# Altium schematic sheet AfternoonCape_RevA2_ADImux.SchDoc
size A2
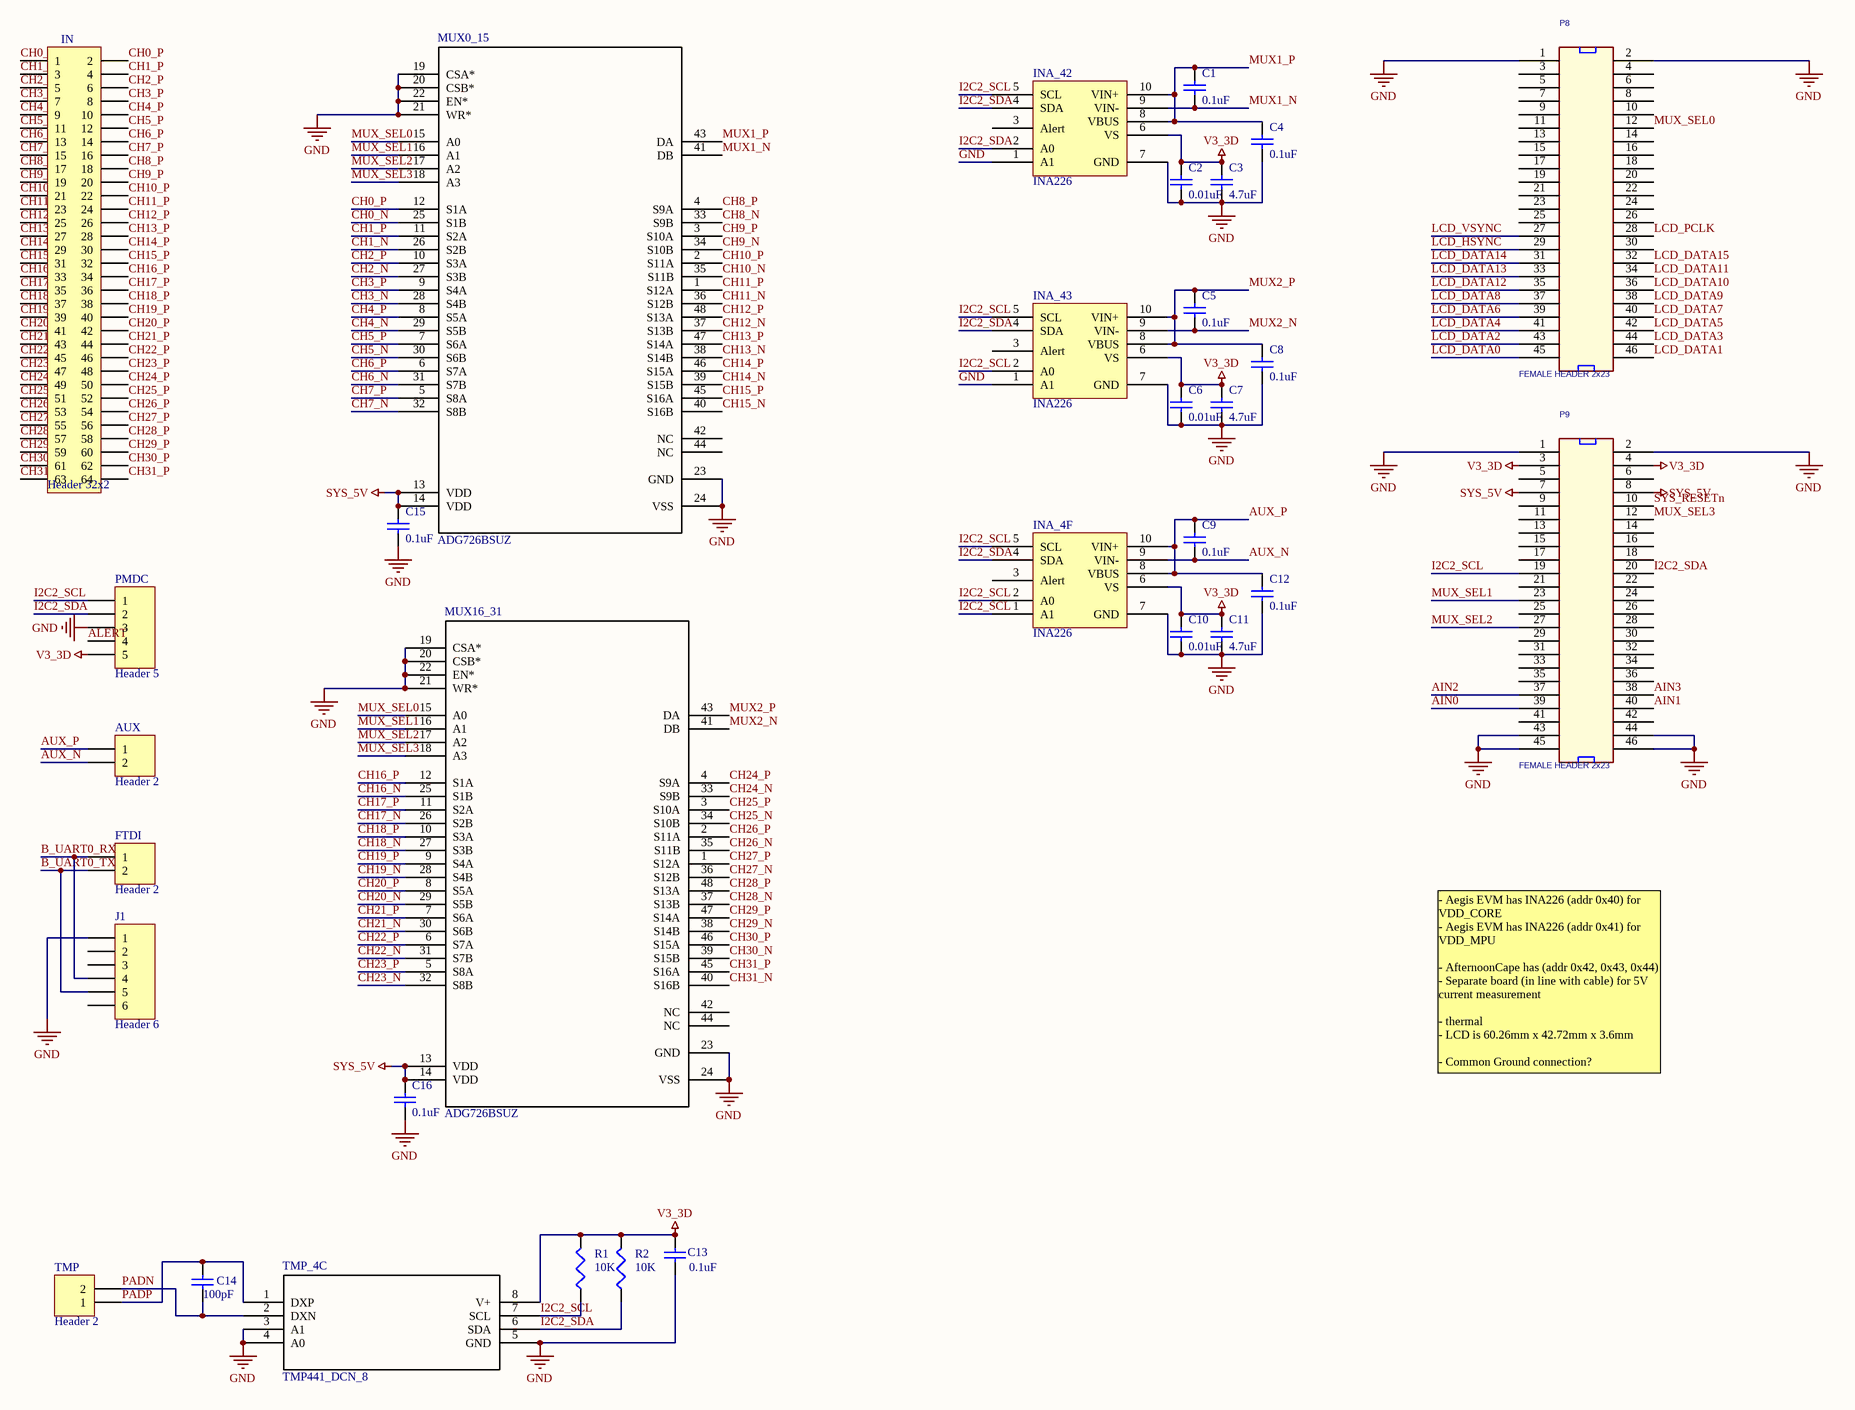
[diagram p0: AfternoonCape_RevA2_ADImux.SchDoc]

## Parts
AUX  Header 2  [HDR1X2]
C1  value 0.1uF  [0402]  (hidden comment: Cap Semi)
C2  value 0.01uF  [0402]  (hidden comment: Cap Semi)
C3  value 4.7uF  [0402]  (hidden comment: Cap Semi)
C4  value 0.1uF  [0402]  (hidden comment: Cap Semi)
C5  value 0.1uF  [0402]  (hidden comment: Cap Semi)
C6  value 0.01uF  [0402]  (hidden comment: Cap Semi)
C7  value 4.7uF  [0402]  (hidden comment: Cap Semi)
C8  value 0.1uF  [0402]  (hidden comment: Cap Semi)
C9  value 0.1uF  [0402]  (hidden comment: Cap Semi)
C10  value 0.01uF  [0402]  (hidden comment: Cap Semi)
C11  value 4.7uF  [0402]  (hidden comment: Cap Semi)
C12  value 0.1uF  [0402]  (hidden comment: Cap Semi)
C13  value 0.1uF  [0402]  (hidden comment: Cap Semi)
C14  value 100pF  [0402]  (hidden comment: Cap Semi)
C15  value 0.1uF  [0402]  (hidden comment: Cap Semi)
C16  value 0.1uF  [0402]  (hidden comment: Cap Semi)
FTDI  Header 2  [HDR1X2]
IN  Header 32x2  [HDR2x32]
INA_4F  INA226  [DGS10]
INA_42  INA226  [DGS10]
INA_43  INA226  [DGS10]
J1  Header 6  [HDR1X6]
MUX0_15  ADG726BSUZ  [SU_48]
MUX16_31  ADG726BSUZ  [SU_48]
P8  FEMALE HEADER 2x23  [HEADER23X2]
P9  FEMALE HEADER 2x23  [HEADER23X2]
PMDC  Header 5  [HDR1X5]
R1  value 10K  [0402]  (hidden comment: Res3)
R2  value 10K  [0402]  (hidden comment: Res3)
TMP  Header 2  [HDR1X2]
TMP_4C  TMP441_DCN_8  [DCN8-L]

## Nets
GND: C2.1 C3.1 C4.1 C6.1 C7.1 C8.1 C10.1 C11.1 C12.1 C13.1 C15.1 C16.1 INA_4F.7(GND) INA_42.1(A1) INA_42.7(GND) INA_43.1(A1) INA_43.7(GND) J1.1 MUX0_15.19(CSA*) MUX0_15.20(CSB*) MUX0_15.21(WR*) MUX0_15.22(EN*) MUX0_15.23(GND) MUX0_15.24(VSS) MUX16_31.19(CSA*) MUX16_31.20(CSB*) MUX16_31.21(WR*) MUX16_31.22(EN*) MUX16_31.23(GND) MUX16_31.24(VSS) P8.1 P8.2 P9.1 P9.2 P9.43 P9.44 P9.45 P9.46 PMDC.3 TMP_4C.3(A1) TMP_4C.4(A0) TMP_4C.5(GND)
SYS_5V: C15.2 C16.2 MUX0_15.13(VDD) MUX0_15.14(VDD) MUX16_31.13(VDD) MUX16_31.14(VDD) P9.7 P9.8
V3_3D: C2.2 C3.2 C6.2 C7.2 C10.2 C11.2 C13.2 INA_4F.6(VS) INA_42.6(VS) INA_43.6(VS) P9.3 P9.4 PMDC.5 R1.2 R2.2 TMP_4C.8(V+)
AIN0: P9.39
AIN1: P9.40
AIN2: P9.37
AIN3: P9.38
ALERT: PMDC.4
AUX_N: AUX.2 C9.1 INA_4F.9(VIN-)
AUX_P: AUX.1 C9.2 C12.2 INA_4F.8(VBUS) INA_4F.10(VIN+)
B_UART0_RX: FTDI.1 J1.4
B_UART0_TX: FTDI.2 J1.5
CH0_N: IN.1 MUX0_15.25(S1B)
CH0_P: IN.2 MUX0_15.12(S1A)
CH1_N: IN.3 MUX0_15.26(S2B)
CH1_P: IN.4 MUX0_15.11(S2A)
CH2_N: IN.5 MUX0_15.27(S3B)
CH2_P: IN.6 MUX0_15.10(S3A)
CH3_N: IN.7 MUX0_15.28(S4B)
CH3_P: IN.8 MUX0_15.9(S4A)
CH4_N: IN.9 MUX0_15.29(S5B)
CH4_P: IN.10 MUX0_15.8(S5A)
CH5_N: IN.11 MUX0_15.30(S6B)
CH5_P: IN.12 MUX0_15.7(S6A)
CH6_N: IN.13 MUX0_15.31(S7B)
CH6_P: IN.14 MUX0_15.6(S7A)
CH7_N: IN.15 MUX0_15.32(S8B)
CH7_P: IN.16 MUX0_15.5(S8A)
CH8_N: IN.17 MUX0_15.33(S9B)
CH8_P: IN.18 MUX0_15.4(S9A)
CH9_N: IN.19 MUX0_15.34(S10B)
CH9_P: IN.20 MUX0_15.3(S10A)
CH10_N: IN.21 MUX0_15.35(S11B)
CH10_P: IN.22 MUX0_15.2(S11A)
CH11_N: IN.23 MUX0_15.36(S12B)
CH11_P: IN.24 MUX0_15.1(S12A)
CH12_N: IN.25 MUX0_15.37(S13B)
CH12_P: IN.26 MUX0_15.48(S13A)
CH13_N: IN.27 MUX0_15.38(S14B)
CH13_P: IN.28 MUX0_15.47(S14A)
CH14_N: IN.29 MUX0_15.39(S15B)
CH14_P: IN.30 MUX0_15.46(S15A)
CH15_N: IN.31 MUX0_15.40(S16B)
CH15_P: IN.32 MUX0_15.45(S16A)
CH16_N: IN.33 MUX16_31.25(S1B)
CH16_P: IN.34 MUX16_31.12(S1A)
CH17_N: IN.35 MUX16_31.26(S2B)
CH17_P: IN.36 MUX16_31.11(S2A)
CH18_N: IN.37 MUX16_31.27(S3B)
CH18_P: IN.38 MUX16_31.10(S3A)
CH19_N: IN.39 MUX16_31.28(S4B)
CH19_P: IN.40 MUX16_31.9(S4A)
CH20_N: IN.41 MUX16_31.29(S5B)
CH20_P: IN.42 MUX16_31.8(S5A)
CH21_N: IN.43 MUX16_31.30(S6B)
CH21_P: IN.44 MUX16_31.7(S6A)
CH22_N: IN.45 MUX16_31.31(S7B)
CH22_P: IN.46 MUX16_31.6(S7A)
CH23_N: IN.47 MUX16_31.32(S8B)
CH23_P: IN.48 MUX16_31.5(S8A)
CH24_N: IN.49 MUX16_31.33(S9B)
CH24_P: IN.50 MUX16_31.4(S9A)
CH25_N: IN.51 MUX16_31.34(S10B)
CH25_P: IN.52 MUX16_31.3(S10A)
CH26_N: IN.53 MUX16_31.35(S11B)
CH26_P: IN.54 MUX16_31.2(S11A)
CH27_N: IN.55 MUX16_31.36(S12B)
CH27_P: IN.56 MUX16_31.1(S12A)
CH28_N: IN.57 MUX16_31.37(S13B)
CH28_P: IN.58 MUX16_31.48(S13A)
CH29_N: IN.59 MUX16_31.38(S14B)
CH29_P: IN.60 MUX16_31.47(S14A)
CH30_N: IN.61 MUX16_31.39(S15B)
CH30_P: IN.62 MUX16_31.46(S15A)
CH31_N: IN.63 MUX16_31.40(S16B)
CH31_P: IN.64 MUX16_31.45(S16A)
I2C2_SCL: INA_4F.1(A1) INA_4F.2(A0) INA_4F.5(SCL) INA_42.5(SCL) INA_43.2(A0) INA_43.5(SCL) P9.19 PMDC.1 R1.1 TMP_4C.7(SCL)
I2C2_SDA: INA_4F.4(SDA) INA_42.2(A0) INA_42.4(SDA) INA_43.4(SDA) P9.20 PMDC.2 R2.1 TMP_4C.6(SDA)
LCD_DATA0: P8.45
LCD_DATA1: P8.46
LCD_DATA2: P8.43
LCD_DATA3: P8.44
LCD_DATA4: P8.41
LCD_DATA5: P8.42
LCD_DATA6: P8.39
LCD_DATA7: P8.40
LCD_DATA8: P8.37
LCD_DATA9: P8.38
LCD_DATA10: P8.36
LCD_DATA11: P8.34
LCD_DATA12: P8.35
LCD_DATA13: P8.33
LCD_DATA14: P8.31
LCD_DATA15: P8.32
LCD_HSYNC: P8.29
LCD_PCLK: P8.28
LCD_VSYNC: P8.27
MUX1_N: C1.1 INA_42.9(VIN-) MUX0_15.41(DB)
MUX1_P: C1.2 C4.2 INA_42.8(VBUS) INA_42.10(VIN+) MUX0_15.43(DA)
MUX2_N: C5.1 INA_43.9(VIN-) MUX16_31.41(DB)
MUX2_P: C5.2 C8.2 INA_43.8(VBUS) INA_43.10(VIN+) MUX16_31.43(DA)
MUX_SEL0: MUX0_15.15(A0) MUX16_31.15(A0) P8.12
MUX_SEL1: MUX0_15.16(A1) MUX16_31.16(A1) P9.23
MUX_SEL2: MUX0_15.17(A2) MUX16_31.17(A2) P9.27
MUX_SEL3: MUX0_15.18(A3) MUX16_31.18(A3) P9.12
PADN: C14.1 TMP.2 TMP_4C.2(DXN)
PADP: C14.2 TMP.1 TMP_4C.1(DXP)
SYS_RESETn: P9.10

Not connected (* = marked no-connect by the designer): INA_4F 3(Alert); INA_42 3(Alert); INA_43 3(Alert); J1 2 3 6; MUX0_15 42(NC) 44(NC); MUX16_31 42(NC) 44(NC); P8 3(2) 4(27) 5(3) 6(28) 7(4) 8(29) 9(5) 10(30) 11(6) 13(7) 14(32) 15(8) 16(33) 17(9) 18(34) 19(10) 20(35) 21(11) 22(36) 23(12) 24(37) 25(13) 26(38) 30(40); P9 5(3) 6(28) 9(5) 11(6) 13(7) 14(32) 15(8) 16(33) 17(9) 18(34) 21(11) 22(36) 24(37) 25(13) 26(38) 28(39) 29(15) 30(40) 31(16) 32(41) 33(17) 34(42) 35(18) 36(43) 41(21) 42(46)

## Notes on the sheet
- - Aegis EVM has INA226 (addr 0x40) for VDD_CORE
  - Aegis EVM has INA226 (addr 0x41) for VDD_MPU
  - AfternoonCape has (addr 0x42, 0x43, 0x44)
  - Separate board (in line with cable) for 5V current measurement
  - thermal
  - LCD is 60.26mm x 42.72mm x 3.6mm
  - Common Ground connection?
- Title
- Size:
- Date:
- File:
- A2
- Number:
- Time:
- Revision:
- Sheet
- of

## Library data of the parts
AUX FTDI TMP = Header 2: Header, 2-Pin; LatestRevisionDate: 17-Jul-2002; LatestRevisionNote: Re-released for DXP Platform.; Publisher: Altium Limited
C1-C16 = Cap Semi: Capacitor (Semiconductor SIM Model); Published: 8-Jun-2000; LatestRevisionDate: 29-May-2009; LatestRevisionNote: IPC-7351 Footprint Added.; PackageReference: C1206; Publisher: Altium Limited; PackageDescription: Chip Capacitor
IN = Header 32x2: Header, 32-Pin, Dual row
J1 = Header 6: 6-pin female header, long legs for FTDI-USB cable; LatestRevisionDate: 17-Jul-2002; LatestRevisionNote: Re-released for DXP Platform.; Publisher: Altium Limited
MUX0_15 MUX16_31 = ADG726BSUZ: Imported; RefDes: RefDes; Type: DEV; Value: Value
P8 P9 = HDR_46_F_2_0.1_0.1: CONN HEADER FMAL 46PS.1" DL GOLD; Manufacturer: Sullins Connector Solutions; Manufacturer Part Number: PPPC232LFBN-RC; Number of Positions: 46; Number of Positions Loaded: All; Pitch: 0.100" (2.54mm); Supplier 1: Digi-Key; Supplier Part Number 1: S7126-ND; RoHS: RoHS Compliant; Category: Connectors, Interconnects; Stock 1: 750; Pricing 1: 1=2.75, 10=2.325, 25=2.2196, 50=2.0084, 100=1.7969, 250=1.58552, 500=1.4798, 1000=1.3741, 2500=1.32125 (USD); Connector Type: Header; Contact Type: Female Socket; Number of Rows: 2; Row Spacing: 0.100" (2.54mm); Mounting Type: Through Hole; Termination: Solder; Fastening Type: -; Features: -; Contact Finish: Gold; Contact Finish Thickness: Flash; Color: Black; Packaging: Bulk; ComponentLink1URL: http://www.sullinscorp.com/drawings/78_P(N)PxCxxxLFBN-RC,_10492-G.pdf; ComponentLink1Description: http://www.sullinscorp.com/drawings/78_P(N)PxCxxxLFBN-RC,_10492-G.pdf
PMDC = Header 5: Header, 5-Pin; LatestRevisionDate: 17-Jul-2002; LatestRevisionNote: Re-released for DXP Platform.; Publisher: Altium Limited
R1 R2 = Res3: Resistor; Published: 8-Jun-2000; LatestRevisionDate: 29-May-2009; LatestRevisionNote: IPC-7351 Footprint Added.; PackageReference: J1-0603; Publisher: Altium Limited; PackageDescription: Chip Resistor
TMP_4C = TMP441_DCN_8: Imported; GENERIC_PART_NUMBER: TMP441; Vendor: Texas Instruments; PACKAGE_DESIGNATOR: DCN; PIN_COUNT: 8; FAMILY_NAME: TEMPERATURE SENSOR; INDUSTRY_STD_PKG_TYPE: SOT-23; Manufacturer_Part_Number: tmp441_dcn_8; Datasheet URL: http://www.ti.com/lit/gpn/TMP441; Manufacturer: Texas Instruments; RefDes: RefDes; Type: DEV; Value: Value